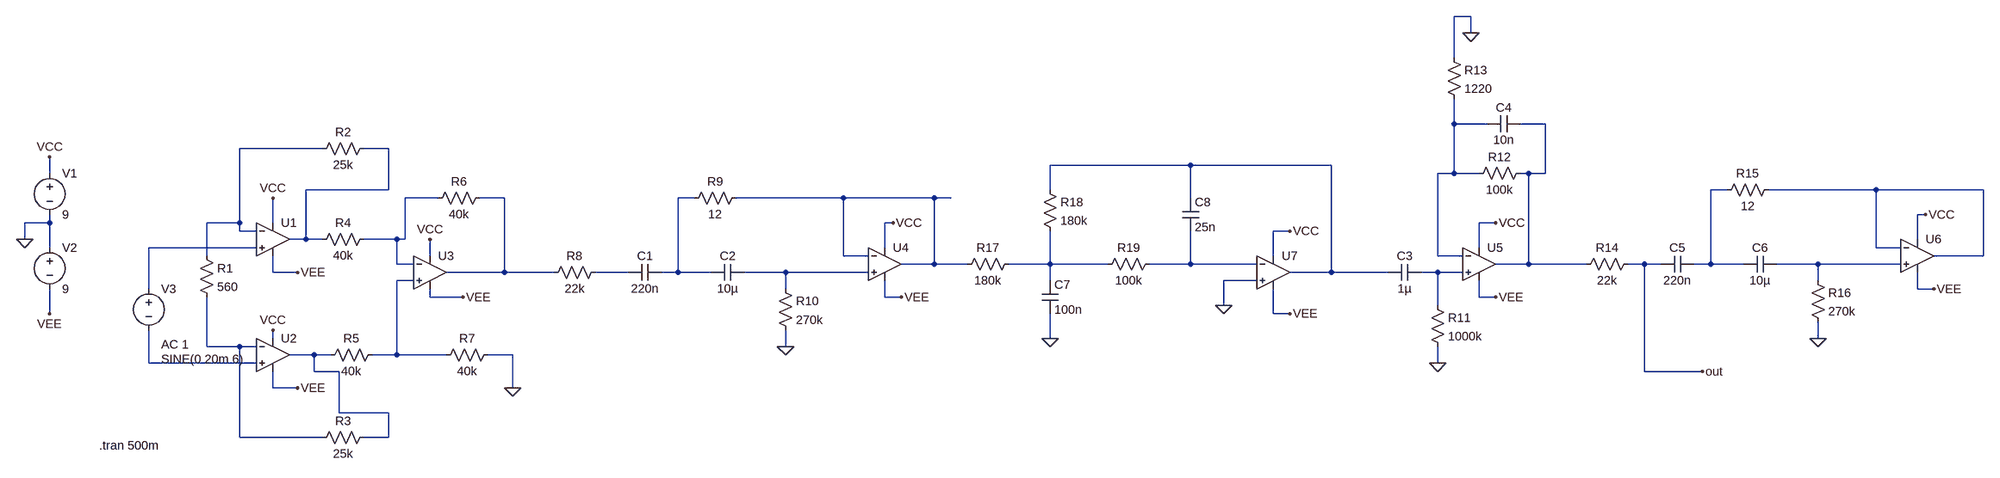
[diagram p0: schematic EEGSim-v2.asc]
EEGSim-v2.asc, the LTspice schematic file:
Version 4
SHEET 1 4580 680
WIRE 2816 -256 2784 -256
WIRE 2816 -224 2816 -256
WIRE 2784 -176 2784 -256
WIRE 2784 -48 2784 -96
WIRE 2848 -48 2784 -48
WIRE 2960 -48 2912 -48
WIRE 464 0 304 0
WIRE 592 0 544 0
WIRE 2144 32 1872 32
WIRE 2416 32 2144 32
WIRE -64 48 -64 16
WIRE 2784 48 2784 -48
WIRE 2784 48 2752 48
WIRE 2832 48 2784 48
WIRE 2928 48 2912 48
WIRE 2960 48 2960 -48
WIRE 2960 48 2928 48
WIRE 592 80 592 0
WIRE 592 80 432 80
WIRE 1872 80 1872 32
WIRE 3312 80 3280 80
WIRE 3600 80 3392 80
WIRE 3808 80 3600 80
WIRE 688 96 624 96
WIRE 816 96 768 96
WIRE 1184 96 1152 96
WIRE 1472 96 1264 96
WIRE 1648 96 1472 96
WIRE 1680 96 1648 96
WIRE 2144 96 2144 32
WIRE 3696 128 3680 128
WIRE -64 144 -64 128
WIRE -64 144 -112 144
WIRE 304 144 304 0
WIRE 304 144 240 144
WIRE 368 144 368 96
WIRE 1568 144 1552 144
WIRE 2864 144 2832 144
WIRE 304 160 304 144
WIRE 336 160 304 160
WIRE 2336 160 2304 160
WIRE -112 176 -112 144
WIRE 432 176 432 80
WIRE 432 176 400 176
WIRE 464 176 432 176
WIRE 608 176 544 176
WIRE 624 176 624 96
WIRE 624 176 608 176
WIRE 3680 176 3680 128
WIRE -64 192 -64 144
WIRE 336 192 128 192
WIRE 1552 192 1552 144
WIRE 2832 192 2832 144
WIRE 3600 192 3600 80
WIRE 3648 192 3600 192
WIRE 240 208 240 144
WIRE 672 208 672 176
WIRE 1472 208 1472 96
WIRE 1520 208 1472 208
WIRE 2304 208 2304 160
WIRE 2752 208 2752 48
WIRE 2800 208 2752 208
WIRE 3808 208 3808 80
WIRE 3808 208 3712 208
WIRE 608 224 608 176
WIRE 640 224 608 224
WIRE 1648 224 1648 96
WIRE 1648 224 1584 224
WIRE 1712 224 1648 224
WIRE 1872 224 1872 160
WIRE 1872 224 1792 224
WIRE 1984 224 1872 224
WIRE 2144 224 2144 160
WIRE 2144 224 2064 224
WIRE 2272 224 2144 224
WIRE 2928 224 2928 48
WIRE 2928 224 2864 224
WIRE 3040 224 2928 224
WIRE 3152 224 3120 224
WIRE 3184 224 3152 224
WIRE 3280 224 3280 80
WIRE 3280 224 3248 224
WIRE 3344 224 3280 224
WIRE 3488 224 3408 224
WIRE 3648 224 3488 224
WIRE 368 240 368 208
WIRE 416 240 368 240
WIRE 816 240 816 96
WIRE 816 240 704 240
WIRE 912 240 816 240
WIRE 1056 240 992 240
WIRE 1152 240 1152 96
WIRE 1152 240 1120 240
WIRE 1216 240 1152 240
WIRE 1360 240 1280 240
WIRE 1520 240 1360 240
WIRE 2416 240 2416 32
WIRE 2416 240 2336 240
WIRE 2656 240 2416 240
WIRE 2752 240 2720 240
WIRE 2800 240 2752 240
WIRE 640 256 608 256
WIRE 1872 256 1872 224
WIRE 2272 256 2208 256
WIRE 3488 256 3488 224
WIRE 128 272 128 192
WIRE 1360 272 1360 240
WIRE 3680 272 3680 240
WIRE 3712 272 3680 272
WIRE 672 288 672 272
WIRE 736 288 672 288
WIRE 1552 288 1552 256
WIRE 1584 288 1552 288
WIRE 2832 288 2832 256
WIRE 2864 288 2832 288
WIRE 2208 304 2208 256
WIRE 2752 304 2752 240
WIRE -64 320 -64 272
WIRE 2304 320 2304 272
WIRE 2336 320 2304 320
WIRE 368 368 368 352
WIRE 1872 368 1872 320
WIRE 3488 368 3488 336
WIRE 240 384 240 288
WIRE 304 384 240 384
WIRE 336 384 304 384
WIRE 1360 384 1360 352
WIRE 448 400 400 400
WIRE 480 400 448 400
WIRE 608 400 608 256
WIRE 608 400 560 400
WIRE 704 400 608 400
WIRE 832 400 784 400
WIRE 128 416 128 352
WIRE 336 416 128 416
WIRE 2752 416 2752 384
WIRE 448 432 448 400
WIRE 496 432 448 432
WIRE 3152 432 3152 224
WIRE 3264 432 3152 432
WIRE 368 464 368 432
WIRE 416 464 368 464
WIRE 832 464 832 400
WIRE 496 512 496 432
WIRE 592 512 496 512
WIRE 304 560 304 384
WIRE 464 560 304 560
WIRE 592 560 592 512
WIRE 592 560 544 560
FLAG -112 176 0
FLAG -64 16 VCC
FLAG -64 320 VEE
FLAG 368 96 VCC
FLAG 368 352 VCC
FLAG 672 176 VCC
FLAG 416 240 VEE
FLAG 416 464 VEE
FLAG 736 288 VEE
FLAG 1360 384 0
FLAG 1568 144 VCC
FLAG 1584 288 VEE
FLAG 832 464 0
FLAG 2752 416 0
FLAG 2864 288 VEE
FLAG 2864 144 VCC
FLAG 2816 -224 0
FLAG 3488 368 0
FLAG 3696 128 VCC
FLAG 3712 272 VEE
FLAG 3264 432 out
FLAG 1872 368 0
FLAG 2208 304 0
FLAG 2336 320 VEE
FLAG 2336 160 VCC
SYMBOL voltage -64 32 R0
WINDOW 123 0 0 Left 0
WINDOW 39 0 0 Left 0
SYMATTR InstName V1
SYMATTR Value 9
SYMBOL voltage -64 176 R0
WINDOW 123 0 0 Left 0
WINDOW 39 0 0 Left 0
SYMATTR InstName V2
SYMATTR Value 9
SYMBOL OpAmps\\UniversalOpAmp2 368 176 R0
SYMATTR InstName U1
SYMBOL OpAmps\\UniversalOpAmp2 368 400 R0
SYMATTR InstName U2
SYMBOL OpAmps\\UniversalOpAmp2 672 240 R0
SYMATTR InstName U3
SYMBOL res 224 192 R0
SYMATTR InstName R1
SYMATTR Value 560
SYMBOL res 560 -16 R90
WINDOW 0 0 56 VBottom 2
WINDOW 3 32 56 VTop 2
SYMATTR InstName R2
SYMATTR Value 25k
SYMBOL res 560 544 R90
WINDOW 0 0 56 VBottom 2
WINDOW 3 32 56 VTop 2
SYMATTR InstName R3
SYMATTR Value 25k
SYMBOL res 560 160 R90
WINDOW 0 0 56 VBottom 2
WINDOW 3 32 56 VTop 2
SYMATTR InstName R4
SYMATTR Value 40k
SYMBOL res 576 384 R90
WINDOW 0 0 56 VBottom 2
WINDOW 3 32 56 VTop 2
SYMATTR InstName R5
SYMATTR Value 40k
SYMBOL res 784 80 R90
WINDOW 0 0 56 VBottom 2
WINDOW 3 32 56 VTop 2
SYMATTR InstName R6
SYMATTR Value 40k
SYMBOL res 800 384 R90
WINDOW 0 0 56 VBottom 2
WINDOW 3 32 56 VTop 2
SYMATTR InstName R7
SYMATTR Value 40k
SYMBOL voltage 128 256 R0
WINDOW 3 24 152 Left 2
WINDOW 123 24 124 Left 2
WINDOW 39 0 0 Left 0
SYMATTR InstName V3
SYMATTR Value SINE(0 20m 6)
SYMATTR Value2 AC 1
SYMBOL res 1008 224 R90
WINDOW 0 0 56 VBottom 2
WINDOW 3 32 56 VTop 2
SYMATTR InstName R8
SYMATTR Value 22k
SYMBOL cap 1120 224 R90
WINDOW 0 0 32 VBottom 2
WINDOW 3 32 32 VTop 2
SYMATTR InstName C1
SYMATTR Value 220n
SYMBOL cap 1280 224 R90
WINDOW 0 0 32 VBottom 2
WINDOW 3 32 32 VTop 2
SYMATTR InstName C2
SYMATTR Value 10µ
SYMBOL res 1280 80 R90
WINDOW 0 0 56 VBottom 2
WINDOW 3 32 56 VTop 2
SYMATTR InstName R9
SYMATTR Value 12
SYMBOL res 1344 256 R0
SYMATTR InstName R10
SYMATTR Value 270k
SYMBOL OpAmps\\UniversalOpAmp2 1552 224 R0
SYMATTR InstName U4
SYMBOL OpAmps\\UniversalOpAmp2 2832 224 R0
SYMATTR InstName U5
SYMBOL cap 2720 224 R90
WINDOW 0 0 32 VBottom 2
WINDOW 3 32 32 VTop 2
SYMATTR InstName C3
SYMATTR Value 1µ
SYMBOL res 2736 288 R0
SYMATTR InstName R11
SYMATTR Value 1000k
SYMBOL res 2928 32 R90
WINDOW 0 0 56 VBottom 2
WINDOW 3 32 56 VTop 2
SYMATTR InstName R12
SYMATTR Value 100k
SYMBOL cap 2912 -64 R90
WINDOW 0 0 32 VBottom 2
WINDOW 3 32 32 VTop 2
SYMATTR InstName C4
SYMATTR Value 10n
SYMBOL res 2768 -192 R0
SYMATTR InstName R13
SYMATTR Value 1220
SYMBOL res 3136 208 R90
WINDOW 0 0 56 VBottom 2
WINDOW 3 32 56 VTop 2
SYMATTR InstName R14
SYMATTR Value 22k
SYMBOL cap 3248 208 R90
WINDOW 0 0 32 VBottom 2
WINDOW 3 32 32 VTop 2
SYMATTR InstName C5
SYMATTR Value 220n
SYMBOL cap 3408 208 R90
WINDOW 0 0 32 VBottom 2
WINDOW 3 32 32 VTop 2
SYMATTR InstName C6
SYMATTR Value 10µ
SYMBOL res 3408 64 R90
WINDOW 0 0 56 VBottom 2
WINDOW 3 32 56 VTop 2
SYMATTR InstName R15
SYMATTR Value 12
SYMBOL res 3472 240 R0
SYMATTR InstName R16
SYMATTR Value 270k
SYMBOL OpAmps\\UniversalOpAmp2 3680 208 R0
SYMATTR InstName U6
SYMBOL OpAmps\\UniversalOpAmp2 2304 240 R0
SYMATTR InstName U7
SYMBOL res 1808 208 R90
WINDOW 0 0 56 VBottom 2
WINDOW 3 32 56 VTop 2
SYMATTR InstName R17
SYMATTR Value 180k
SYMBOL cap 1856 256 R0
SYMATTR InstName C7
SYMATTR Value 100n
SYMBOL res 1856 64 R0
SYMATTR InstName R18
SYMATTR Value 180k
SYMBOL res 2080 208 R90
WINDOW 0 0 56 VBottom 2
WINDOW 3 32 56 VTop 2
SYMATTR InstName R19
SYMATTR Value 100k
SYMBOL cap 2128 96 R0
SYMATTR InstName C8
SYMATTR Value 25n
TEXT 32 576 Left 2 !.tran 500m

The netlist it stands for:
* EEGSim-v2.asc
V1 VCC 0 9
V2 0 VEE 9
XU1 N012 N003 VCC VEE N004 level2 Avol=1Meg GBW=10Meg Slew=10Meg Ilimit=25m Rail=0 Vos=0 En=0 Enk=0 In=0 Ink=0 Rin=500Meg  ; pins In+ In- V+ V- OUT
XU2 N022 N020 VCC VEE N021 level2 Avol=1Meg GBW=10Meg Slew=10Meg Ilimit=25m Rail=0 Vos=0 En=0 Enk=0 In=0 Ink=0 Rin=500Meg  ; pins In+ In- V+ V- OUT
XU3 N019 N008 VCC VEE N009 level2 Avol=1Meg GBW=10Meg Slew=10Meg Ilimit=25m Rail=0 Vos=0 En=0 Enk=0 In=0 Ink=0 Rin=500Meg  ; pins In+ In- V+ V- OUT
R1 N003 N020 560
R2 N004 N003 25k
R3 N021 N020 25k
R4 N008 N004 40k
R5 N019 N021 40k
R6 N009 N008 40k
R7 0 N019 40k
V3 N012 N022 SINE(0 20m 6) AC 1
R8 N016 N009 22k
C1 N010 N016 220n
C2 N017 N010 10µ
R9 N011 N010 12
R10 N017 0 270k
XU4 N017 N011 VCC VEE N011 level2 Avol=1Meg GBW=10Meg Slew=10Meg Ilimit=25m Rail=0 Vos=0 En=0 Enk=0 In=0 Ink=0 Rin=500Meg  ; pins In+ In- V+ V- OUT
XU5 N018 N001 VCC VEE N002 level2 Avol=1Meg GBW=10Meg Slew=10Meg Ilimit=25m Rail=0 Vos=0 En=0 Enk=0 In=0 Ink=0 Rin=500Meg  ; pins In+ In- V+ V- OUT
C3 N018 N005 1µ
R11 N018 0 1000k
R12 N002 N001 100k
C4 N002 N001 10n
R13 0 N001 1220
R14 out N002 22k
C5 N006 out 220n
C6 N015 N006 10µ
R15 N007 N006 12
R16 N015 0 270k
XU6 N015 N007 VCC VEE N007 level2 Avol=1Meg GBW=10Meg Slew=10Meg Ilimit=25m Rail=0 Vos=0 En=0 Enk=0 In=0 Ink=0 Rin=500Meg  ; pins In+ In- V+ V- OUT
XU7 0 N014 VCC VEE N005 level2 Avol=1Meg GBW=10Meg Slew=10Meg Ilimit=25m Rail=0 Vos=0 En=0 Enk=0 In=0 Ink=0 Rin=500Meg  ; pins In+ In- V+ V- OUT
R17 N013 N011 180k
C7 N013 0 100n
R18 N005 N013 180k
R19 N014 N013 100k
C8 N005 N014 25n
.tran 500m
.lib UniversalOpAmp2.lib
.backanno
.end